# EAGLE design USB-Weather (EAGLE 6.5.0)

## Sheet 1 of 2
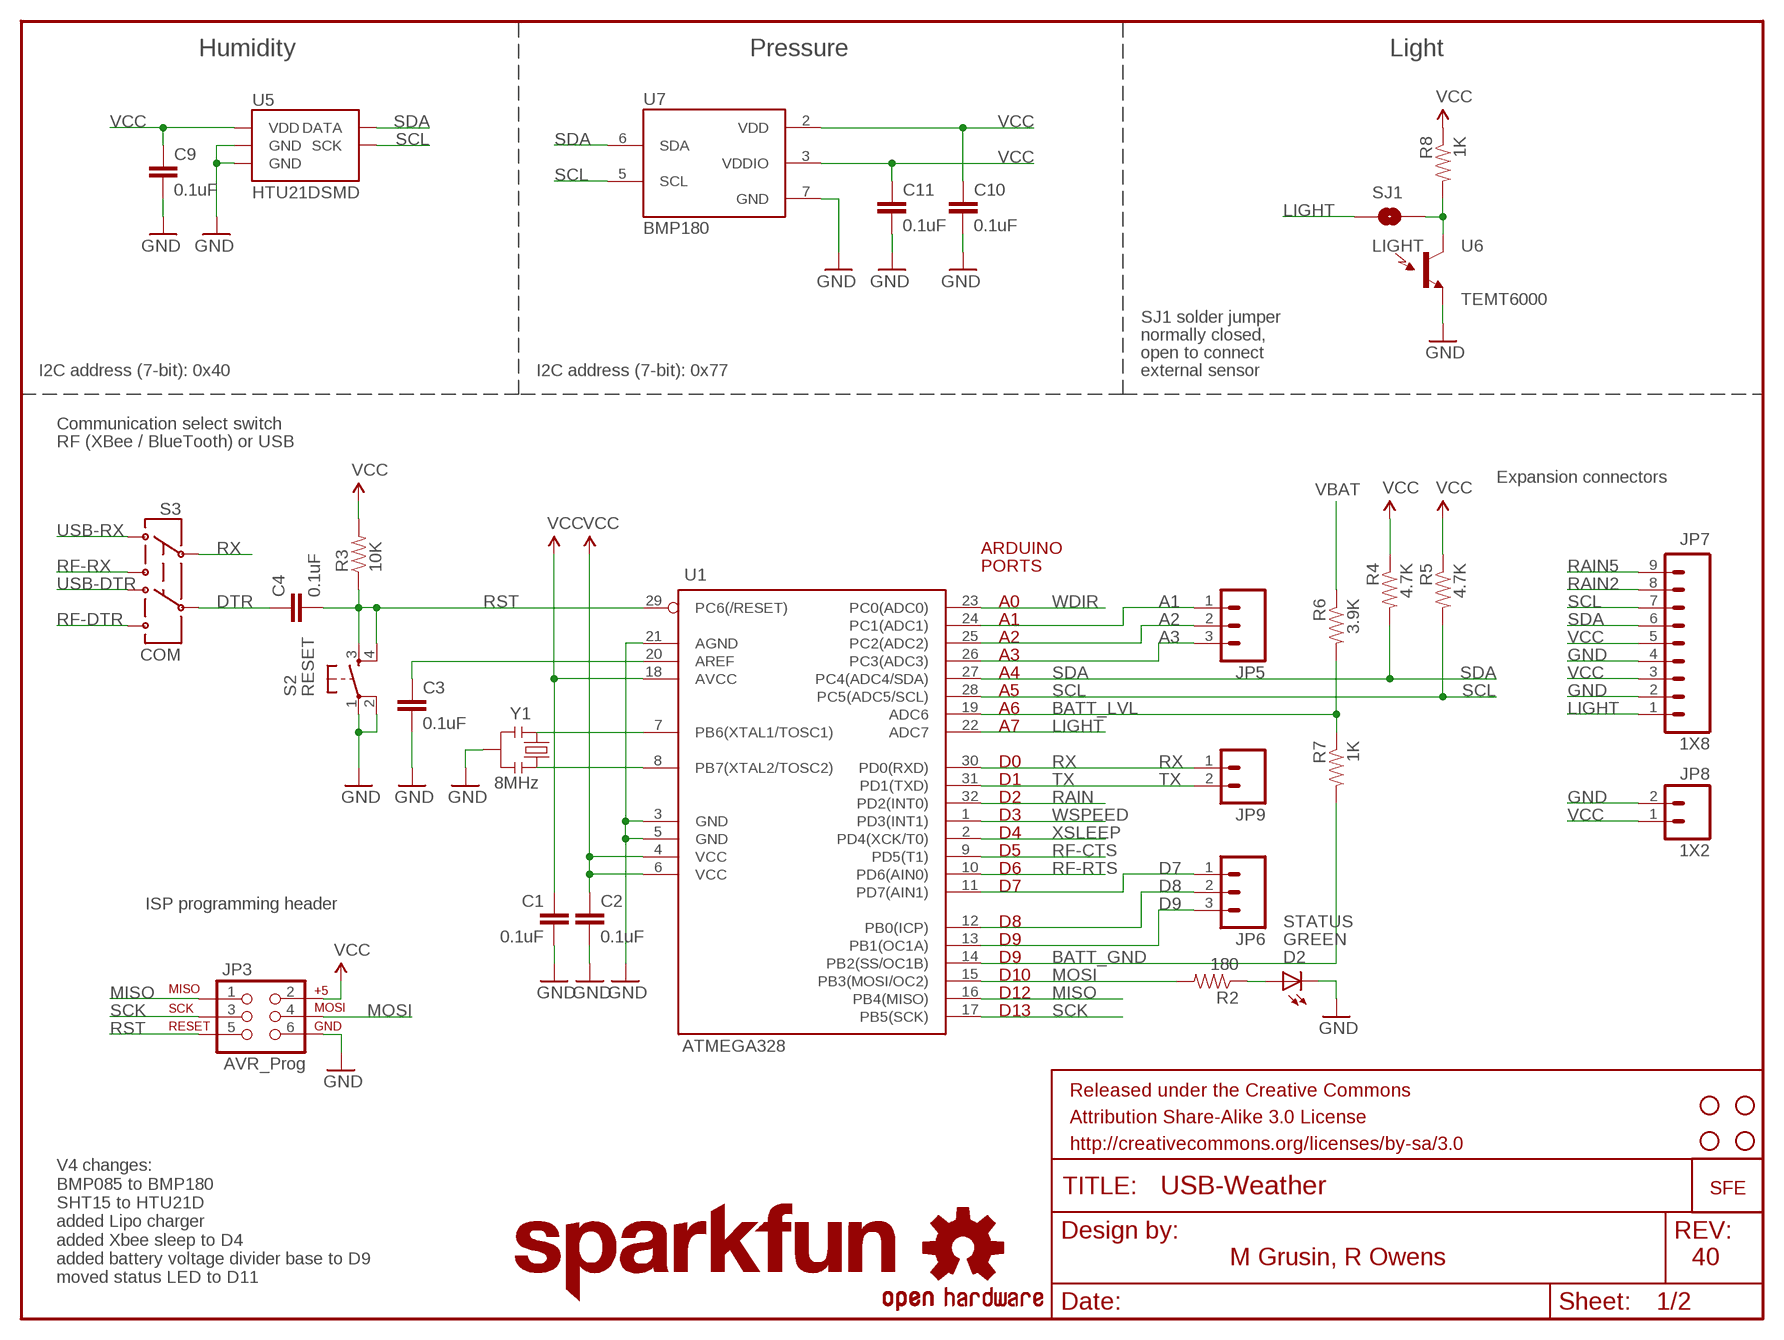
[diagram p0: schematic, sheet 1]

### Parts
C1  0.1uF  CAP0603-CAP  [0603-CAP]
C2  0.1uF  CAP0603-CAP  [0603-CAP]
C3  0.1uF  CAP0603-CAP  [0603-CAP]
C4  0.1uF  CAP0603-CAP  [0603-CAP]
C9  0.1uF  CAP0603-CAP  [0603-CAP]
C10  0.1uF  CAP0603-CAP  [0603-CAP]
C11  0.1uF  CAP0603-CAP  [0603-CAP]
D2  GREEN  LED0603  [LED-0603]
FRAME3  FRAME-LETTER  [CREATIVE_COMMONS]
JP3  AVR_Prog  AVR_SPI_PRG_6PTH  [2X3]
JP5  M03_ROUND_ONLY_NO_SILK  [1X03_ROUND_ONLY_NO_SILK]
JP6  M03_ROUND_ONLY_NO_SILK  [1X03_ROUND_ONLY_NO_SILK]
JP7  1X8  M09  [1X09]
JP8  1X2  M021X02_NO_SILK  [1X02_NO_SILK]
JP9  M021X02_NO_SILK  [1X02_NO_SILK]
LOGO1  LOGO-SFENEW  [SFE-NEW-WEBLOGO]
LOGO2  OSHW-LOGOS  [OSHW-LOGO-S]
LOGO3  SFE_LOGO_NAME.1_INCH  [SFE_LOGO_NAME_.1]
R2  180  RESISTOR0603-RES  [0603-RES]
R3  10K  RESISTOR0603-RES  [0603-RES]
R4  4.7K  RESISTOR0603-RES  [0603-RES]
R5  4.7K  RESISTOR0603-RES  [0603-RES]
R6  3.9K  RESISTOR0603-RES  [0603-RES]
R7  1K  RESISTOR0603-RES  [0603-RES]
R8  1K  RESISTOR0603-RES  [0603-RES]
S2  RESET  TAC_SWITCHSMD  [TACTILE_SWITCH_SMD]
S3  COM  SWITCH-DPDTSMD  [AYZ0202]
SJ1  LIGHT  SOLDERJUMPERNC  [SJ_2S]
U1  ATMEGA328  AVR-MEGA8-AI  [TQFP32-08]
U5  HTU21DSMD  [HTU21D]
U6  TEMT6000  [TEMT6000-SEN]
U7  BMP180  [BMP180]
U$2  STAND-OFF  [STAND-OFF]
U$3  STAND-OFF  [STAND-OFF]
U$4  STAND-OFF  [STAND-OFF]
U$5  STAND-OFF  [STAND-OFF]
Y1  8MHz  RESONATORSMD  [RESONATOR-SMD]

### Nets
A1: JP5.1 U1.24(PC1(ADC1))
A2: JP5.2 U1.25(PC2(ADC2))
A3: JP5.3 U1.26(PC3(ADC3))
BATT_GND: R7.2 U1.14(PB2(SS/OC1B))
BATT_LVL: R6.2 R7.1 U1.19(ADC6)
D7: JP6.1 U1.11(PD7(AIN1))
D8: JP6.2 U1.12(PB0(ICP))
D9: JP6.3 U1.13(PB1(OC1A))
DTR: C4.1 S3.5
GND: C1.2 C2.2 C3.2 C9.2 C10.2 C11.2 D2.C JP3.6 JP7.2 JP7.4 JP8.2 S2.1 S2.2 U1.3(GND) U1.5(GND) U1.21(AGND) U5.7(GND) U5.GND U6.EMITTER(E1) U7.7(GND) Y1.2 ; also sheet 2
LIGHT: JP7.1 SJ1.1 U1.22(ADC7)
MISO: JP3.1 U1.16(PB4(MISO))
MOSI: JP3.4 R2.2 U1.15(PB3(MOSI/OC2))
N$5: D2.A R2.1
N$8: C3.1 U1.20(AREF)
N$9: R8.2 SJ1.2 U6.COLLECTOR(C1)
N$10: U1.7(PB6(XTAL1/TOSC1)) Y1.1
N$14: U1.8(PB7(XTAL2/TOSC2)) Y1.3
RAIN: U1.32(PD2(INT0)) ; also sheet 2
RAIN2: JP7.8 ; also sheet 2
RAIN5: JP7.9 ; also sheet 2
RF-CTS: U1.9(PD5(T1)) ; also sheet 2
RF-DTR: S3.6 ; also sheet 2
RF-RTS: U1.10(PD6(AIN0)) ; also sheet 2
RF-RX: S3.3 ; also sheet 2
RST: C4.2 JP3.5 R3.1 S2.3 S2.4 U1.29(PC6(/RESET))
RX: JP9.1 S3.2 U1.30(PD0(RXD))
SCK: JP3.3 U1.17(PB5(SCK))
SCL: JP7.7 R5.2 U1.28(PC5(ADC5/SCL)) U5.SCK U7.5(SCL)
SDA: JP7.6 R4.2 U1.27(PC4(ADC4/SDA)) U5.DATA U7.6(SDA)
TX: JP9.2 U1.31(PD1(TXD)) ; also sheet 2
USB-DTR: S3.4 ; also sheet 2
USB-RX: S3.1 ; also sheet 2
VBAT: R6.1 ; also sheet 2
VCC: C1.1 C2.1 C9.1 C10.1 C11.1 JP3.2 JP7.3 JP7.5 JP8.1 R3.2 R4.1 R5.1 R8.1 U1.4(VCC) U1.6(VCC) U1.18(AVCC) U5.VDD U7.2(VDD) U7.3(VDDIO) ; also sheet 2
WDIR: U1.23(PC0(ADC0)) ; also sheet 2
WSPEED: U1.1(PD3(INT1)) ; also sheet 2
XSLEEP: U1.2(PD4(XCK/T0)) ; also sheet 2

### Notes on the sheet
- Humidity | Pressure | Light
- SJ1 solder jumper
- normally closed,
- open to connect
- I2C address (7-bit): 0x40 | I2C address (7-bit): 0x77 | external sensor
- Communication select switch
- RF (XBee / BlueTooth) or USB
- Expansion connectors
- ARDUINO
- PORTS
- A0
- A1
- A2
- A3
- A4
- A5
- A6
- A7
- D0
- D1
- D2
- D3
- D4
- D5
- D6
- D7
- ISP programming header
- D8 | STATUS
- D9
- D9
- D10
- D12
- D13
- M Grusin, R Owens | 40
- V4 changes:
  BMP085 to BMP180
  SHT15 to HTU21D
  added Lipo charger
  added Xbee sleep to D4
  added battery voltage divider base to D9
  moved status LED to D11

## Sheet 2 of 2
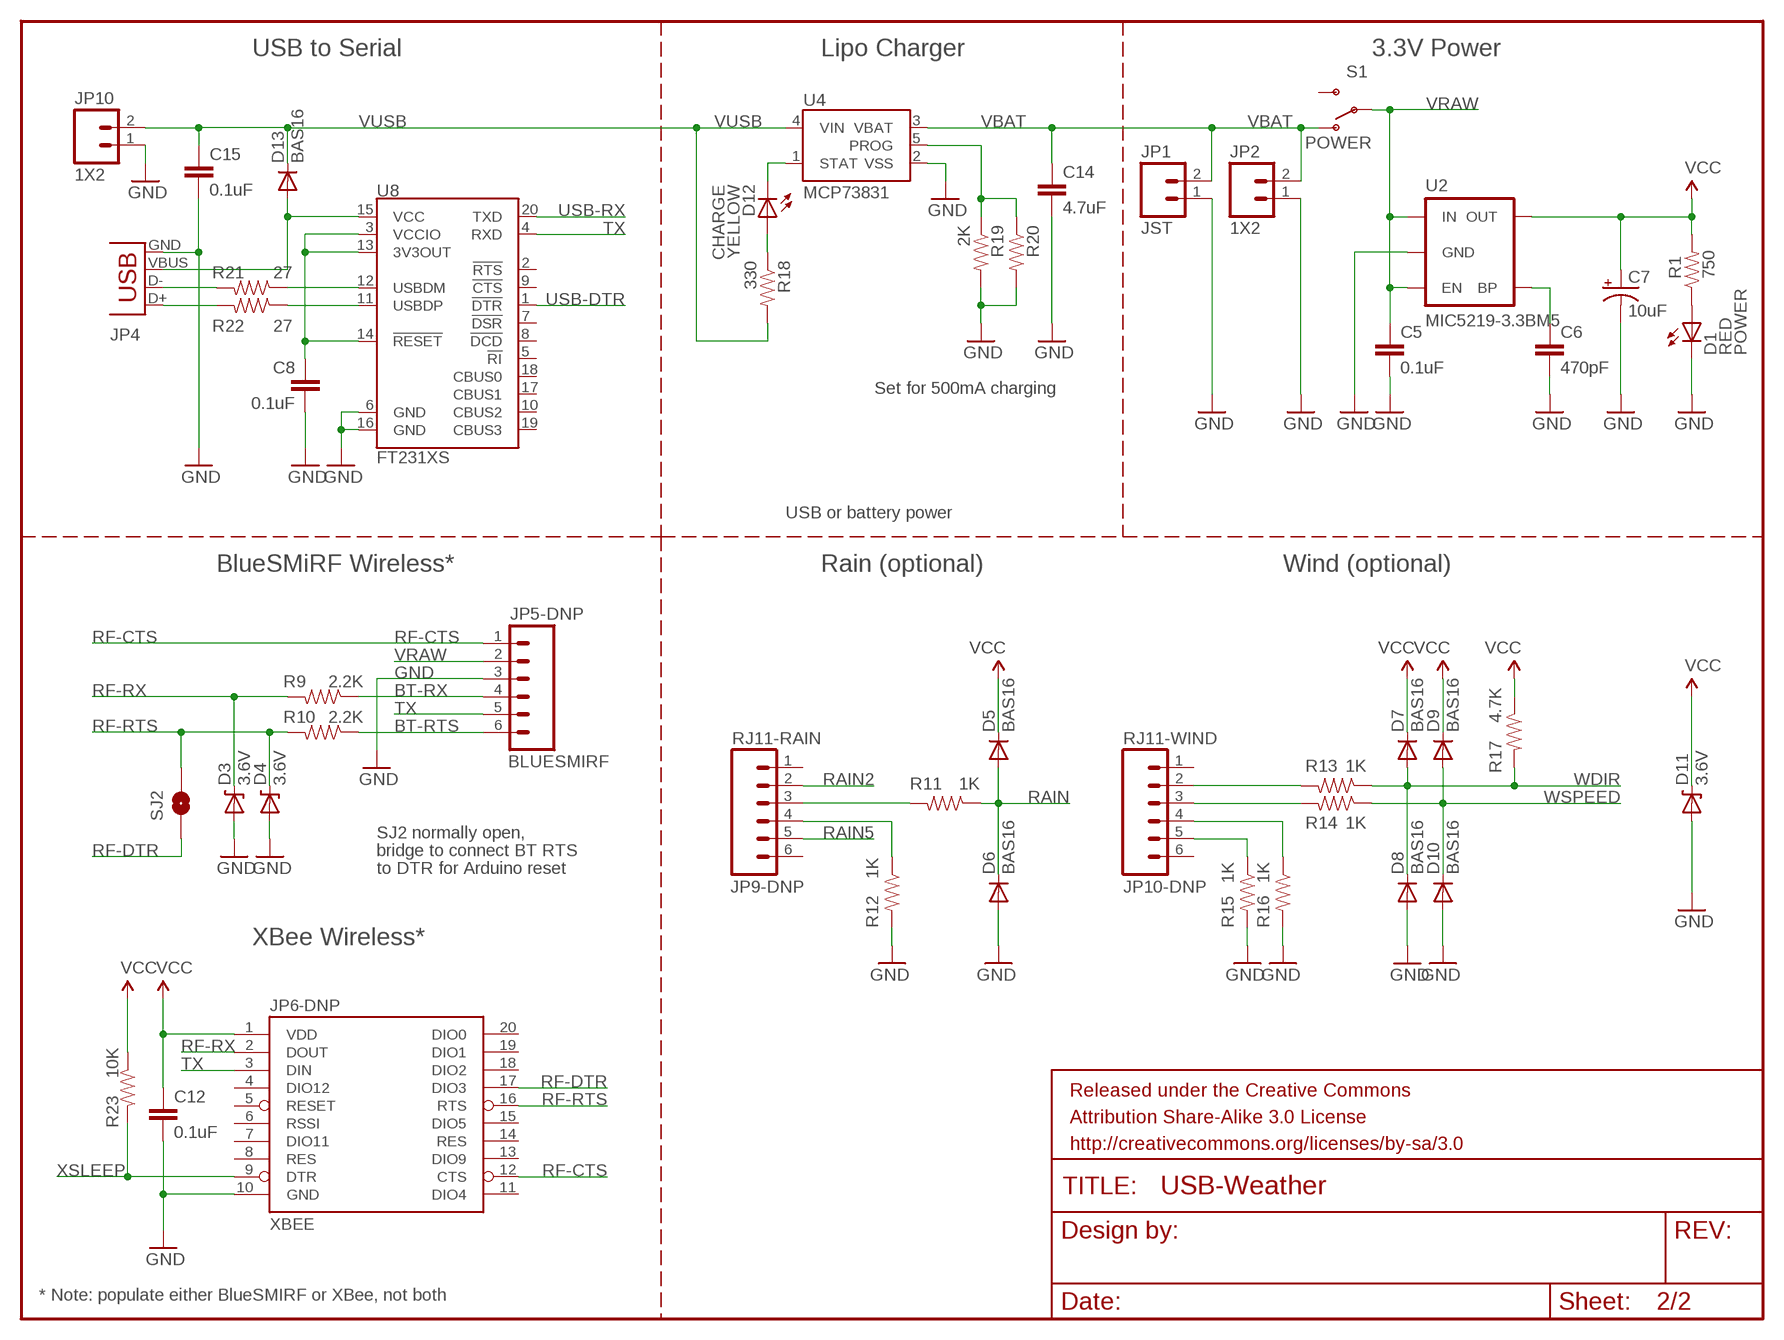
[diagram p1: schematic, sheet 2]

### Parts
C5  0.1uF  CAP0603-CAP  [0603-CAP]
C6  470pF  CAP0603-CAP  [0603-CAP]
C7  10uF  CAP_POL1206  [EIA3216]
C8  0.1uF  CAP0603-CAP  [0603-CAP]
C12  0.1uF  CAP0603-CAP  [0603-CAP]
C14  4.7uF  CAP0603-CAP  [0603-CAP]
C15  0.1uF  CAP0603-CAP  [0603-CAP]
D1  RED  LED0603  [LED-0603]
D3  3.6V  DIODE-ZENER-BZT52  [SOD-323]
D4  3.6V  DIODE-ZENER-BZT52  [SOD-323]
D5  BAS16  DIODESOD  [SOD-323]
D6  BAS16  DIODESOD  [SOD-323]
D7  BAS16  DIODESOD  [SOD-323]
D8  BAS16  DIODESOD  [SOD-323]
D9  BAS16  DIODESOD  [SOD-323]
D10  BAS16  DIODESOD  [SOD-323]
D11  3.6V  DIODE-ZENER-BZT52  [SOD-323]
D12  YELLOW  LED0603  [LED-0603]
D13  BAS16  DIODESOD  [SOD-323]
FRAME1  FRAME-LETTER  [CREATIVE_COMMONS]
JP1  JST  M02-JST-2MM-SMT  [JST-2-SMD]
JP2  1X2  M021X02_NO_SILK  [1X02_NO_SILK]
JP4  USBSMD  [USB-MINIB]
JP5-DNP  BLUESMIRF  M06SIP  [1X06]
JP6-DNP  XBEE  XBEE-1B1  [XBEE-1]
JP9-DNP  RJ11-RAIN  RJ11-6PTH  [RJ11-6]
JP10  1X2  M021X02_NO_SILK  [1X02_NO_SILK]
JP10-DNP  RJ11-WIND  RJ11-6PTH  [RJ11-6]
R1  750  RESISTOR0603-RES  [0603-RES]
R9  2.2K  RESISTOR0603-RES  [0603-RES]
R10  2.2K  RESISTOR0603-RES  [0603-RES]
R11  1K  RESISTOR0603-RES  [0603-RES]
R12  1K  RESISTOR0603-RES  [0603-RES]
R13  1K  RESISTOR0603-RES  [0603-RES]
R14  1K  RESISTOR0603-RES  [0603-RES]
R15  1K  RESISTOR0603-RES  [0603-RES]
R16  1K  RESISTOR0603-RES  [0603-RES]
R17  4.7K  RESISTOR0603-RES  [0603-RES]
R18  330  RESISTOR0603-RES  [0603-RES]
R19  2K  RESISTOR0603-RES  [0603-RES]
R20  RESISTORPTH-1/6W  [1/6W-RES]
R21  27  RESISTOR0603-RES  [0603-RES]
R22  27  RESISTOR0603-RES  [0603-RES]
R23  10K  RESISTOR0603-RES  [0603-RES]
S1  POWER  SWITCH-SPSTSMD  [AYZ0202]
SJ2  SOLDERJUMPERNO  [SJ_2S-NO]
U2  MIC5219-3.3BM5  V_REG_LDOSMD  [SOT23-5]
U4  MCP73831  [SOT23-5]
U8  FT231XS  [SSOP20_L]

### Nets
BT-RTS: JP5-DNP.6 R10.1
BT-RX: JP5-DNP.4 R9.1
GND: C5.2 C6.2 C7.C(-) C8.2 C12.2 C14.2 C15.2 D1.C D3.2(A) D4.2(A) D6.2(A) D8.2(A) D10.2(A) D11.2(A) JP1.1 JP2.1 JP4.GND JP5-DNP.3 JP6-DNP.10(GND) JP10.1 R12.2 R15.2 R16.2 R19.2 R20.2 U2.2(GND) U4.2(VSS) U8.6(GND) U8.16(GND) ; also sheet 1
N$1: D1.A R1.1
N$2: JP10-DNP.2 R13.2
N$3: JP10-DNP.3 R14.2
N$6: C6.1 U2.4(BP)
N$7: JP9-DNP.3 R11.2
N$11: JP9-DNP.4 R12.1
N$12: JP10-DNP.5 R15.1
N$13: JP10-DNP.4 R16.1
N$22: D12.A R18.1
N$23: JP4.D- R21.2
N$24: JP4.D+ R22.2
N$25: D13.2(A) JP4.VBUS U8.15(VCC)
N$26: C8.1 U8.3(VCCIO) U8.13(3V3OUT) U8.14(!RESET)
PROG: R19.1 R20.1 U4.5(PROG)
RAIN: D5.2(A) D6.1(C) R11.1 ; also sheet 1
RAIN2: JP9-DNP.2 ; also sheet 1
RAIN5: JP9-DNP.5 ; also sheet 1
RF-CTS: JP5-DNP.1 JP6-DNP.12(CTS) ; also sheet 1
RF-DTR: JP6-DNP.17(DIO3) SJ2.1 ; also sheet 1
RF-RTS: D4.1(C) JP6-DNP.16(RTS) R10.2 SJ2.2 ; also sheet 1
RF-RX: D3.1(C) JP6-DNP.2(DOUT) R9.2 ; also sheet 1
STAT: D12.C U4.1(STAT)
TX: JP5-DNP.5 JP6-DNP.3(DIN) U8.4(RXD) ; also sheet 1
USB-DTR: U8.1(!DTR) ; also sheet 1
USB-RX: U8.20(TXD) ; also sheet 1
USB_D+: R22.1 U8.11(USBDP)
USB_D-: R21.1 U8.12(USBDM)
VBAT: C14.1 JP1.2 JP2.2 S1.1(O) U4.3(VBAT) ; also sheet 1
VCC: C7.A(+) C12.1 D5.1(C) D7.1(C) D9.1(C) D11.1(C) JP6-DNP.1(VDD) R1.2 R17.1 R23.1 U2.5(OUT) ; also sheet 1
VRAW: C5.1 JP5-DNP.2 S1.2(P) U2.1(IN) U2.3(EN)
VUSB: C15.1 D13.1(C) JP10.2 R18.2 U4.4(VIN)
WDIR: D7.2(A) D8.1(C) R13.1 R17.2 ; also sheet 1
WSPEED: D9.2(A) D10.1(C) R14.1 ; also sheet 1
XSLEEP: JP6-DNP.9(DTR) R23.2 ; also sheet 1
Unconnected: JP6-DNP.4(DIO12) JP6-DNP.5(RESET) JP6-DNP.6(RSSI) JP6-DNP.7(DIO11) JP6-DNP.8(RES) JP6-DNP.11(DIO4) JP6-DNP.13(DIO9) JP6-DNP.14(RES) JP6-DNP.15(DIO5) JP6-DNP.18(DIO2) JP6-DNP.19(DIO1) JP6-DNP.20(DIO0) JP9-DNP.1 JP9-DNP.6 JP10-DNP.1 JP10-DNP.6 S1.3(S) U8.2(!RTS) U8.5(!RI) U8.7(!DSR) U8.8(!DCD) U8.9(!CTS) U8.10(CBUS2) U8.17(CBUS1) U8.18(CBUS0) U8.19(CBUS3)

### Notes on the sheet
- USB to Serial | Lipo Charger | 3.3V Power
- CHARGE
- JP4
- POWER
- Set for 500mA charging
- USB or battery power
- Rain (optional) | Wind (optional)
- BlueSMiRF Wireless*
- SJ2 normally open,
- bridge to connect BT RTS
- to DTR for Arduino reset
- XBee Wireless*
- * Note: populate either BlueSMIRF or XBee, not both

## Library data of the parts
C1-C6 C8-C12 C14 C15 = SparkFun:CAP: Capacitor Standard 0603 ceramic capacitor, and 0.1" leaded capacitor.
C7 = SparkFun:CAP_POL: Capacitor Polarized These are standard SMD and PTH capacitors. Normally 10uF, 47uF, and 100uF in electrolytic and tantalum varieties. Always verify the external diameter of the through hole cap, it varies with capacity, voltage, and manufacturer. The EIA devices should be standard.
D1 D2 D12 = SparkFun:LED: LEDs Standard schematic elements and footprints for 5mm, 3mm, 1206, and 0603 sized LEDs. 5mm - Spark Fun Electronics SKU : COM-00529 (and others)
D3 D4 D11 = SparkFun:DIODE-ZENER: Zener Diode Production Part - 8199 3.4V Zener Voltage
D5-D10 D13 = SparkFun:DIODE: Diode These are standard reverse protection diodes and small signal diodes. SMA package can handle up to about 1A. SOD-323 can handle about 200mA. What the SOD-323 package when ordering, there are some mfgs out there that are 5-pin packages.
FRAME1 FRAME3 = SparkFun-Aesthetics:FRAME-LETTER: Schematic Frame Standard 8.5x11 US Letter frame
JP1 JP2 JP10 = SparkFun:M02: Header 2 Standard 2-pin 0.1" header. Use with straight break away headers (SKU : PRT-00116), right angle break away headers (PRT-00553), swiss pins (PRT-00743), machine pins (PRT-00117), and female headers (PRT-00115). Molex polarized connector foot print use with SKU : PRT-08233 with associated crimp pins and housings.
JP3 = mike-temp:AVR_SPI_PRG_6: AVR ISP 6 Pin This is the reduced ISP connector for AVR programming. Common on Arduino. This footprint will take up less PCB space and can be used with a 10-pin to 6-pin adapter such as SKU: BOB-08508
JP4 = SparkFun:USB: USB Connectors USB-B-PTH is fully proven SKU : PRT-00139 USB-miniB is fully proven SKU : PRT-00587 USB-A-PCB is untested. USB-A-H is throughly reviewed, but untested. Spark Fun Electronics SKU : PRT-00437 USB-B-SMT is throughly reviewed, but untested. Needs silkscreen touching up. USB-A-S has not been used/tested USB-MB-H has not been used/tested
JP5 JP6 = mike-temp:M03: Header 3 Standard 3-pin 0.1" header. Use with straight break away headers (SKU : PRT-00116), right angle break away headers (PRT-00553), swiss pins (PRT-00743), machine pins (PRT-00117), and female headers (PRT-00115). Molex polarized connector foot print use with SKU : PRT-08232 with associated crimp pins and housings.
JP5-DNP = SparkFun:M06: Header 6 Standard 6-pin 0.1" header. Use with straight break away headers (SKU : PRT-00116), right angle break away headers (PRT-00553), swiss pins (PRT-00743), machine pins (PRT-00117), and female headers (PRT-00115). Molex polarized connector foot print use with SKU : PRT-08094 with associated crimp pins and housings. NOTES ON THE VARIANTS LOCK and LOCK_LONGPADS... This footprint was designed to help hold the alignment of a through-hole component (i.e. 6-pin header) while soldering it into place. You may notice that each hole has been shifted either up or down by 0.005 of an inch from it's more standard position (which is a perfectly straight line). This slight alteration caused the pins (the squares in the middle) to touch the edges of the holes. Because they are alternating, it causes a "brace" to hold the component in place. 0.005 has proven to be the perfect amount of "off-center" position when using our standard breakaway headers. Although looks a little odd when you look at the bare footprint, once you have a header in there, the alteration is very hard to notice. Also, if you push a header all the way into place, it is covered up entirely on the bottom side. This idea of altering the position of holes to aid alignment will be further integrated into the Sparkfun Library for other footprints. It can help hold any component with 3 or more connection pins.
JP6-DNP = SparkFun:XBEE-1
JP7 = SparkFun:M09: Header 9 Standard 9-pin 0.1" header. Use with straight break away headers (SKU : PRT-00116), right angle break away headers (PRT-00553), swiss pins (PRT-00743), machine pins (PRT-00117), and female headers (PRT-00115).
JP8 JP9 = mike-temp:M02: Header 2 Standard 2-pin 0.1" header. Use with straight break away headers (SKU : PRT-00116), right angle break away headers (PRT-00553), swiss pins (PRT-00743), machine pins (PRT-00117), and female headers (PRT-00115). Molex polarized connector foot print use with SKU : PRT-08233 with associated crimp pins and housings.
JP9-DNP JP10-DNP = SparkFun:RJ11-6: RJ11 Jack Simple 6 pin RJ11 jack. Commonly found on CAT3 devices and Microchip programmers. SKU: PRT-00132
LOGO1 = SparkFun-Aesthetics:LOGO-SFE: Spark Fun Electronics PCB Logo This is the standard Spark Fun Electronics PCB logo.
LOGO2 = SparkFun-Aesthetics:OSHW-LOGO: Open Source Hardware Logo This logo indicates the piece of hardware it is found on incorporates a OSHW license and/or adheres to the definition of open source hardware found here: http://freedomdefined.org/OSHW
LOGO3 = SparkFun-Aesthetics:SFE_LOGO_NAME: SFE Logo, name only This is the SparkFun name logo. The logo on the schematic will always be the same size; the package variant is the height of the flame part of the logo (or the height the flame would be, if it were drawn). Default layer for the logo on the board is tSilk.
R1-R23 = SparkFun:RESISTOR: Resistor Basic schematic elements and footprints for 0603, 1206, and PTH resistors.
S1 = SparkFun:SWITCH-SPST: SPST Switch Simple slide switch. Spark Fun Electronics SKU : COM-00102
S2 = SparkFun:TAC_SWITCH: Momentary Switch Button commonly used for reset or general input. Spark Fun Electronics SKU : COM-00097
S3 = SparkFun:SWITCH-DPDT: DPDT Version of the COM-00597
SJ1 SJ2 = SparkFun:SOLDERJUMPER: Solder Jumper Standard SMD solder jumper. Used to automate production. Two varients : Normally Open and Normally Closed are the same, but have different paste layers. NC will have a large amount of paste and should jumper during reflow.
U1 = SparkFun:AVR-MEGA8: MICROCONTROLLER 8 Kbytes FLASH 1 kbytes SRAM 512 bytes EEPROM USART 6-channel 10 bit ADC 2-channel 8 bit ADC
U2 = SparkFun:V_REG_LDO: Voltage Regulator LDO Standard 150mA LDO voltage regulator in SOT-23 layout. Micrel part MIC5205. BP (by-pass) pin is used to lower output noise with 470pF cap.; SFENUM: VREG-9872
U4 = SparkFun:MCP73831: Microchip's MCP73831 Miniature single cell, fully integrated Li-Ion, Li-polymer charge management controller http://ww1.microchip.com/downloads/en/DeviceDoc/21984a.pdf
U5 = SparkFun-Sensors:HTU21D
U6 = SparkFun:TEMT6000: Ambient Light Sensor Simple light detection sensor. Output varies with light intensity input. Spark Fun Electronics SKU : COM-08348
U7 = SparkFun-Sensors:BMP180: BOSCH BMP180 DIGITAL BAROMETRIC PRESSURE SENSOR Web page: http://www.bosch-sensortec.com/en/homepage/products_3/environmental_sensors_1/bmp180_1/bmp180 Datasheet: http://ae-bst.resource.bosch.com/media/products/dokumente/bmp180/BST-BMP180-DS000-09.pdf The BMP180 is the function compatible successor of the BMP085, a new generation of high precision digital pressure sensors for consumer applications. The ultra-low power, low voltage electronics of the BMP180 is optimized for use in mobile phones, PDAs, GPS navigation devices and outdoor equipment. With a low altitude noise of merely 0.25m at fast conversion time, the BMP180 offers superior performance. The I2C interface allows for easy system integration with a microcontroller. The BMP180 is based on piezo-resistive technology for EMC robustness, high accuracy and linearity as well as long term stability. Key features: - Temperature measurement included - I2C interface - Fully calibrated - Pb-free, halogen-free and RoHS compliant, - MSL 1 Basic specs: Pressure range: 300 to 1100hPa (+9000m to -500m relating to sea level) Supply voltage: 1.8 to 3.6V (VDD), 1.62V to 3.6V (VDDIO) Package: LGA package with metal lid Small footprint: 3.6mm x 3.8mm Super-flat: 0.93mm height Low power: 5μA at 1 sample / sec. in standard mode Low noise: 0.06hPa (0.5m) in ultra low power mode, 0.02hPa (0.17m) advanced resolution mode Typical applications: - Enhancement of GPS navigation (dead-reckoning, slope detection, etc.) - In- and out-door navigation - Leisure and sports - Weather forecast - Vertical velocity indication (rise/sink speed)
U8 = mike-temp:FT231X: FTDI FT231X Full Speed USB to Full-handshake UART This USB2.0 Full Speed IC offers a compact bridge to full handshake UART interfaces. The device is a UART, capable of operating up to 3MBaud, with low power consumption (8mA). The FT231X includes the complete FT-X series feature set and enables USB to be added into a system design quickly and easily over a UART interface.
U$2-U$5 = SparkFun:STAND-OFF: Stand Off This is the mechanical footprint for a #4 phillips button head screw. Use the keepout ring to avoid running the screw head into surrounding components. SKU : PRT-00447
Y1 = SparkFun:RESONATOR: Resonator Small SMD resonator. This is the itty bitty 10/20MHz resonators with built in caps. CSTCE10M0G55 and CSTCE20M0V53. Footprint has been reviewed closely but hasn't been tested yet.

## Net classes
0 Default: width 0.203 mm
1 Power: width 0.305 mm

## Board
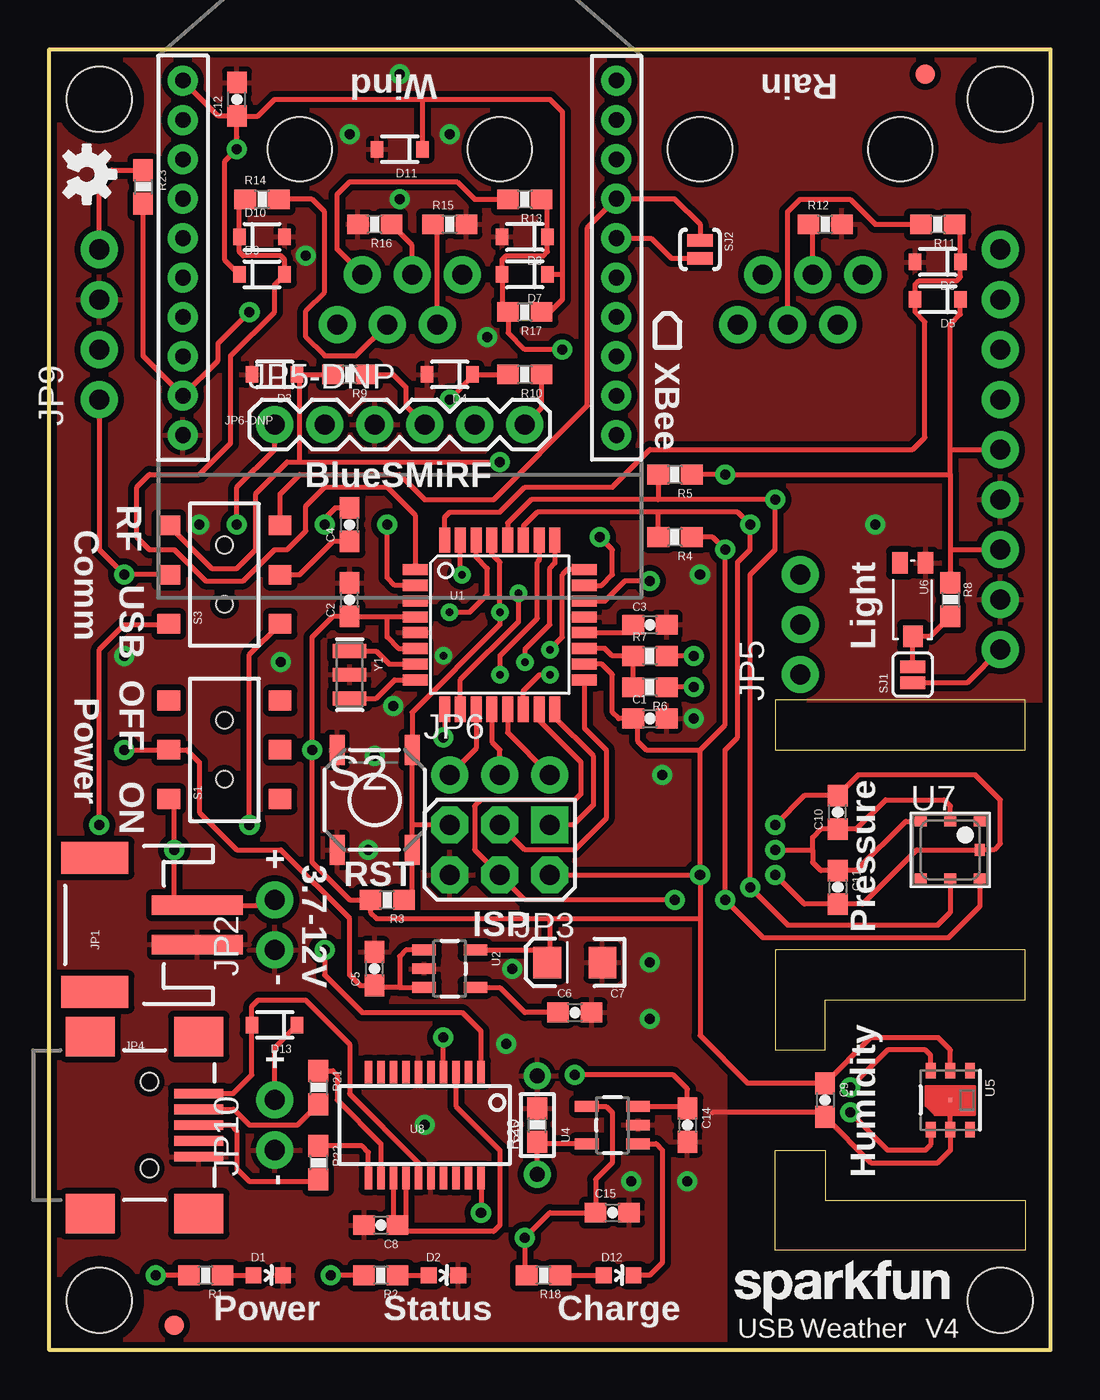
[diagram p2: board, top side]
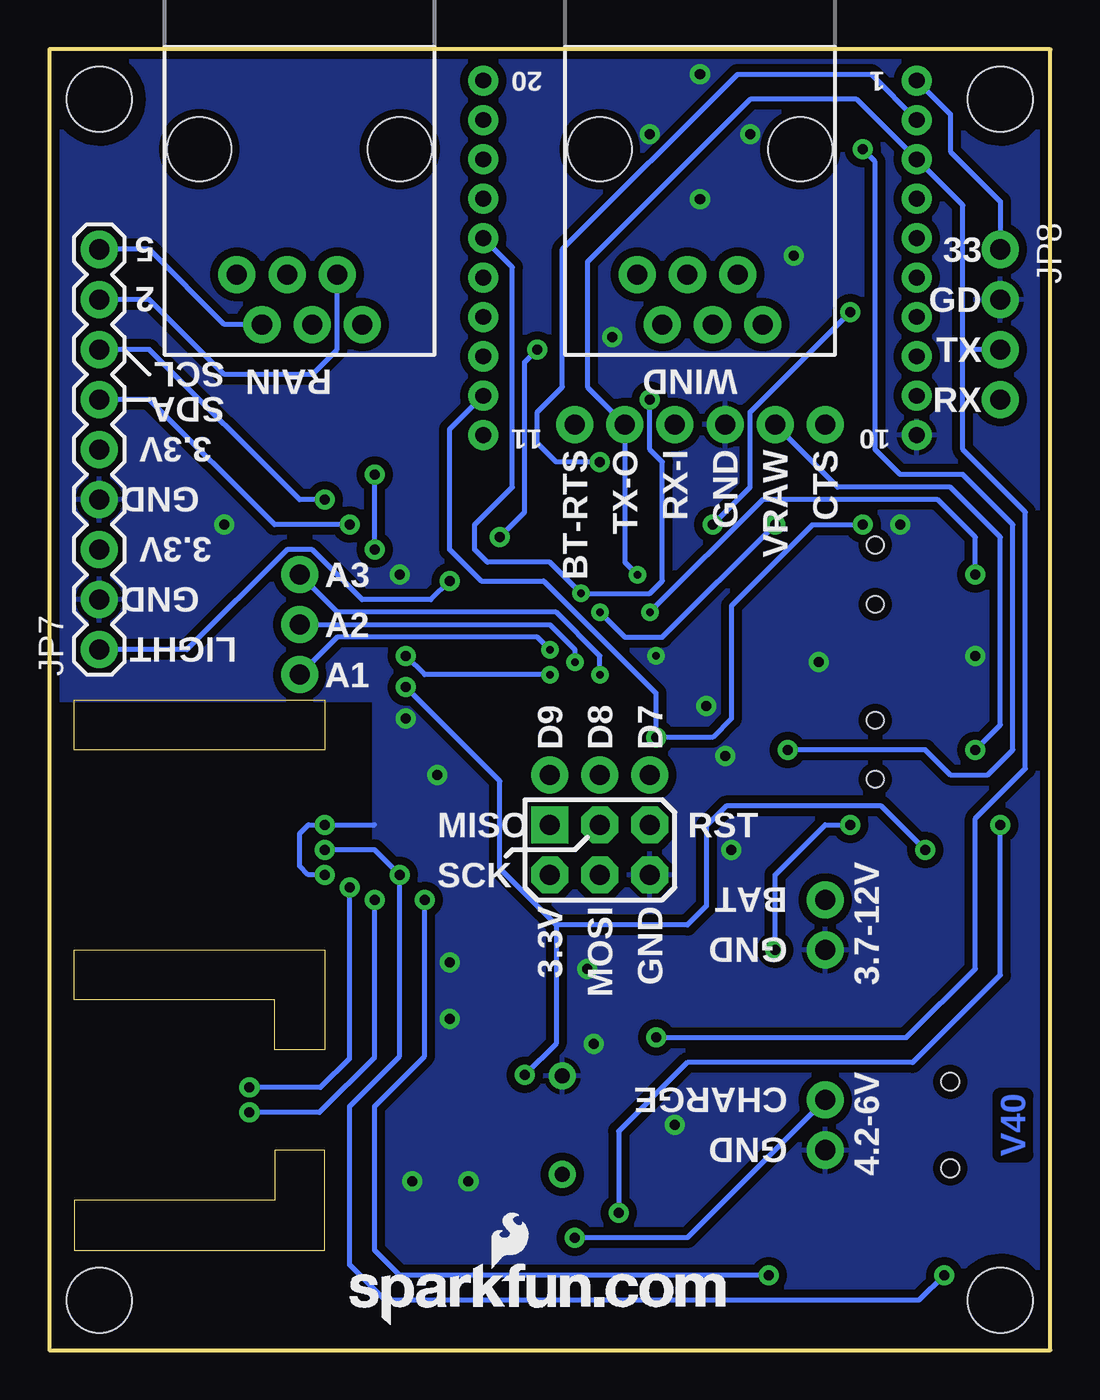
[diagram p3: board, bottom side, seen from below]

Size 50.8 x 66.04 mm. Coordinates in mm from the lower left corner, seen from the top.
Outline: 0,66.04 50.8,66.04 50.8,0 0,0 0,66.04
Copper layers (1*16): Top 0.035mm / dielectric 1.5mm / Bottom 0.035mm
Design rules "SparkFun": minimum track width 7mil, minimum drill 15mil, track to track 8mil, track to pad 8mil, pad to pad 8mil, via to via 8mil, smd to smd 8mil, copper to edge 8mil, drill to drill 8mil, minimum pad ring 12mil, minimum via ring 10mil, stop-mask expansion 4mil, vias tented up to drill 20mil, thermal gap 10mil
Milling: area 36.8,15.2 to 49.5,20.3; area 36.8,5.1 to 49.5,10.2; area 36.8,30.5 to 49.5,33

### Footprints (pad centres in the part's own frame; a part is rotated, then mirrored left to right if it is on the bottom)
0603-CAP = smd 1.1 x 1: 1 -0.85,0; 2 0.85,0
EIA3216 = smd 1.4 x 1.6: A 1.4,0; C -1.4,0
LED-0603 = smd 0.8 x 0.8: A 0,-0.75; C 0,0.75
SOD-323 = smd 0.63 x 0.83: 1 -1.15,0; 2 1.15,0
FIDUCIAL-1X2 = smd 1 x 1: 1 0,0
JST-2-SMD = smd 1 x 4.6: 1 -1,-3.7; 2 1,-3.7 | smd 1.6 x 3.4: NC1 -3.4,1.5; NC2 3.4,1.5
1X02_NO_SILK = drill 1.016 pad 1.88: 1 0,0; 2 2.54,0
2X3 = drill 1.016 pad 1.88 square: 1 0,0 | drill 1.016 pad 1.88 octagon: 2 0,2.54; 3 2.54,0; 4 2.54,2.54; 5 5.08,0; 6 5.08,2.54
USB-MINIB = smd 2.5 x 0.5: D+ 2.5,0; D- 2.5,0.8; GND 2.5,-1.6; ID 2.5,-0.8; VBUS 2.5,1.6 | smd 2.5 x 2: MTN1 -3,4.5; MTN2 2.5,4.5; MTN3 -3,-4.5; MTN4 2.5,-4.5 | hole 0.9: 0,2.2; 0,-2.2
1X03_ROUND_ONLY_NO_SILK = drill 1.016 pad 1.88: 1 0,0; 2 2.54,0; 3 5.08,0
1X06 = drill 1.016 pad 1.88: 1 0,0; 2 2.54,0; 3 5.08,0; 4 7.62,0; 5 10.16,0; 6 12.7,0
XBEE-1 = drill 0.8 pad 1.524: 1 -11,20; 2 -11,18; 3 -11,16; 4 -11,14; 5 -11,12; 6 -11,10; 7 -11,8; 8 -11,6; 9 -11,4; 10 -11,2; 11 11,2; 12 11,4; 13 11,6; 14 11,8; 15 11,10; 16 11,12; 17 11,14; 18 11,16; 19 11,18; 20 11,20
1X09 = drill 1.016 pad 1.88: 1 0,0; 2 2.54,0; 3 5.08,0; 4 7.62,0; 5 10.16,0; 6 12.7,0; 7 15.24,0; 8 17.78,0; 9 20.32,0
RJ11-6 = drill 1.016 pad 1.88: 1 1.905,8.89; 2 3.175,6.35; 3 4.445,8.89; 4 5.715,6.35; 5 6.985,8.89; 6 8.255,6.35 | hole 3.251: 0,0; 10.16,0
0603-RES = smd 1.1 x 1: 1 -0.85,0; 2 0.85,0
1/6W-RES = drill 0.762: 1 -2.5,0; 2 2.5,0
AYZ0202 = smd 1 x 1.15: 1 -2.5,2.825; 2 0,2.825; 3 2.5,2.825; 4 -2.5,-2.825; 5 0,-2.825; 6 2.5,-2.825 | hole 0.85: 1.5,0; -1.5,0
TACTILE_SWITCH_SMD = smd 1.524 x 0.762: 1 -2.54,1.905; 2 2.54,1.905; 3 -2.54,-1.905; 4 2.54,-1.905
SJ_2S = smd 0.635 x 1.27: 1 -0.412,0; 2 0.412,0
SJ_2S-NO = smd 0.635 x 1.27: 1 -0.45,0; 2 0.45,0
TQFP32-08 = smd 1.27 x 0.559: 1 -4.293,2.8; 2 -4.293,2; 3 -4.293,1.2; 4 -4.293,0.4; 5 -4.293,-0.4; 6 -4.293,-1.2; 7 -4.293,-2; 8 -4.293,-2.8; 17 4.293,-2.8; 18 4.293,-2; 19 4.293,-1.2; 20 4.293,-0.4; 21 4.293,0.4; 22 4.293,1.2; 23 4.293,2; 24 4.293,2.8 | smd 0.559 x 1.27: 9 -2.8,-4.293; 10 -2,-4.293; 11 -1.2,-4.293; 12 -0.4,-4.293; 13 0.4,-4.293; 14 1.2,-4.293; 15 2,-4.293; 16 2.8,-4.293; 25 2.8,4.293; 26 2,4.293; 27 1.2,4.293; 28 0.4,4.293; 29 -0.4,4.293; 30 -1.2,4.293; 31 -2,4.293; 32 -2.8,4.293
SOT23-5 = smd 0.55 x 1.2: 1 -0.95,-1.3; 2 0,-1.3; 3 0.95,-1.3; 4 0.95,1.3; 5 -0.95,1.3
HTU21D = smd 0.2 x 0.2: 7 0,0 | smd 0.8 x 0.5: DATA 1.5,-1; GND 1.5,0; NC@1 -1.5,1; NC@6 1.5,1; SCK -1.5,-1; VDD -1.5,0
TEMT6000-SEN = smd 1.1 x 0.8: BASE -1.87,-0.65; EMITTER -1.87,0.65 | smd 1.1 x 1: COLLECTOR 1.86,0.01
BMP180 = smd 0.6 x 0.5: 1 1.5,1.45; 2 0,1.45; 3 -1.5,1.45; 4 -1.5,-1.45; 5 0,-1.45; 6 1.5,-1.45 | smd 0.5 x 0.6: 7 1.5,0
SSOP20_L = smd 0.381 x 1.143: 1 -2.857,-2.68; 2 -2.223,-2.68; 3 -1.587,-2.68; 4 -0.953,-2.68; 5 -0.318,-2.68; 6 0.318,-2.68; 7 0.953,-2.68; 8 1.587,-2.68; 9 2.223,-2.68; 10 2.857,-2.68; 11 2.857,2.68; 12 2.223,2.68; 13 1.587,2.68; 14 0.953,2.68; 15 0.318,2.68; 16 -0.318,2.68; 17 -0.953,2.68; 18 -1.587,2.68; 19 -2.223,2.68; 20 -2.857,2.68
STAND-OFF = hole 3.302: 0,0
RESONATOR-SMD = smd 0.7 x 1.7: 1 -1.2,0; 2 0,0; 3 1.2,0

### Placement (x,y rotation side)
C1  30.48,32.07 0 top
C2  15.24,38.1 90 top
C3  30.48,36.83 0 top
C4  15.24,41.91 90 top
C5  16.51,19.37 90 top
C6  26.67,17.14 0 top
C7  26.67,19.68 180 top
C8  16.83,6.35 180 top
C9  39.37,12.7 270 top
C10  40.01,27.3 90 top
C11  40.01,23.5 270 top
C12  9.53,63.5 90 top
C14  32.38,11.43 270 top
C15  28.57,6.99 0 top
D1  11.11,3.81 270 top
D2  20,3.81 270 top
D3  11.43,49.53 180 top
D4  20.32,49.53 180 top
D5  45.09,53.34 180 top
D6  45.09,55.24 180 top
D7  24.13,54.61 180 top
D8  24.13,56.52 180 top
D9  10.79,54.61 0 top
D10  10.79,56.52 0 top
D11  17.78,60.96 180 top
D12  28.89,3.81 270 top
D13  11.43,16.51 180 top
E$1  [FIDUCIAL-1X2]  44.45,64.77 0 top
E$2  [FIDUCIAL-1X2]  6.35,1.27 0 top
FRAME1  -8.89,-16.51 0 top  (outside the outline)
FRAME3  -8.89,-16.51 0 top  (outside the outline)
JP1  3.81,21.59 90 top
JP2  11.43,20.32 90 top
JP3  25.4,26.67 180 top
JP4  5.08,11.43 0 top
JP5  38.1,34.29 90 top
JP5-DNP  11.43,46.99 0 top
JP6  20.32,29.21 0 top
JP6-DNP  17.78,44.45 0 top
JP7  48.26,35.56 90 bottom
JP8  2.54,55.88 270 bottom
JP9  2.54,48.26 90 top
JP9-DNP  33.02,60.96 180 bottom
JP10  11.43,10.16 90 top
JP10-DNP  12.7,60.96 180 bottom
LOGO1  35.56,1.27 0 bottom
LOGO2  1.91,59.69 270 top
LOGO3  34.29,1.27 0 top
R1  7.94,3.81 180 top
R2  16.83,3.81 180 top
R3  17.14,22.86 180 top
R4  31.75,41.27 180 top
R5  31.75,44.45 180 top
R6  30.48,33.66 180 top
R7  30.48,35.24 0 top
R8  45.72,38.1 270 top
R9  15.24,49.53 180 top
R10  24.13,49.53 180 top
R11  45.09,57.15 180 top
R12  39.37,57.15 0 top
R13  24.13,58.42 180 top
R14  10.79,58.42 0 top
R15  20.32,57.15 0 top
R16  16.51,57.15 180 top
R17  24.13,52.7 180 top
R18  25.08,3.81 180 top
R19  24.77,11.43 90 top
R20  24.77,11.43 90 top
R21  13.65,13.34 270 top
R22  13.65,9.53 270 top
R23  4.76,59.05 270 top
S1  8.89,30.48 90 top
S2  16.51,27.94 90 top
S3  8.89,39.37 90 top
SJ1  43.81,34.29 90 top
SJ2  33.02,55.88 270 top
U1  22.86,36.83 0 top
U2  20.32,19.37 270 top
U4  28.57,11.43 90 top
U5  45.72,12.7 270 top
U6  43.81,38.1 270 top
U7  45.72,25.4 0 top
U8  19.05,11.43 180 top
U$2  2.54,2.54 0 top
U$3  48.26,2.54 0 top
U$4  2.54,63.5 0 top
U$5  48.26,63.5 0 top
Y1  15.24,34.29 270 top

### Tracks (layer width: path | path; a pad name or v marks a point on that pad's centre or on a via)
A1  (via drill 0.38)
  Top 0.254: U1.24 26.3,39.63 26.04,39.37 26.04,36.2 v25.4,35.56
  Bottom 0.254: v25.4,35.56 26.04,36.2 36.2,36.2 JP5.1
A2  (via drill 0.38)
  Top 0.254: v24.13,34.92 24.13,35.56 25.4,36.83 25.4,39.69 25.66,39.95 U1.25
  Bottom 0.254: JP5.2 25.4,36.83 24.13,35.56 v24.13,34.92
A3  (via drill 0.38)
  Top 0.254: v22.86,34.29 22.86,35.24 24.77,37.15 24.77,40.01 24.86,40.1 U1.26
  Bottom 0.254: v22.86,34.29 22.86,35.24 25.08,37.47 36.2,37.47 JP5.3
BATT_GND  (via drill 0.38, 0.51)
  Top 0.254: U1.14 24.06,33.47 24.88,34.29 v25.4,34.29 | v32.7,35.24 R7.2
  Bottom 0.254: v25.4,34.29 31.75,34.29 v32.7,35.24
BATT_LVL
  Top 0.254: U1.19 28.19,35.63 28.57,35.24 R7.1 R6.2
BT-RTS
  Top 0.254: JP5-DNP.6 24.98,47.84 R10.1
BT-RX
  Top 0.254: R9.1 17.46,49.53 18.1,48.9 18.1,47.94 JP5-DNP.4
D7
  Top 0.254: U1.11 21.66,30.55 JP6.1
D8
  Top 0.254: JP6.2 22.86,30.48 22.46,30.88 U1.12
D9
  Top 0.254: U1.13 23.26,31.35 JP6.3
DTR
  Top 0.254: S3.5 12.7,39.37 14.39,41.06 C4.1
GND  (via drill 0.38, 0.51)
  Top 0.254: v36.83,26.67 38.31,28.16 C10.2 41.06,29.21 46.99,29.21 48.26,27.94 48.26,25.72 47.94,25.4 U7.7 | v36.83,24.13 38.31,22.64 C11.2 41.27,22.64 44.03,25.4 46.99,25.4 | 33.66,12.06 39.37,12.06 C9.2 41.7,9.53 45.09,9.53 45.72,10.16 U5.GND U5.7
  Bottom 0.254: 34.29,26.67 v36.83,26.67 37.65,26.67 38.1,26.22 38.1,24.58 37.65,24.13 v36.83,24.13
  other vias: 17.46,32.7 13.02,55.56 20.32,61.72 32.7,32.07 23.18,15.56 16.19,25.4 19.05,11.43 30.48,19.68 20,35.24 30.48,16.83 3.81,35.24 31.11,29.21 41.91,41.91 33.02,39.37 15.24,61.72 22.23,51.44 17.78,58.42 17.78,64.77 7.62,41.91 11.75,34.92 23.5,19.37 16.51,30.16 32.38,8.57 29.53,8.57
  pour Bottom (isolate 0.406): 34.29,0 34.29,33.02 50.8,33.02 50.8,66.04 0,66.04 0,0
  pour Top (isolate 0.305): 34.29,0 34.29,33.02 50.8,33.02 50.8,66.04 0,66.04 0,0
LIGHT  (via drill 0.51)
  Top 0.254: SJ1.1 46.58,33.88 JP7.1 | U1.22 28.19,38.03 29.21,39.05 v30.48,39.05
  Bottom 0.254: v30.48,39.05 31.43,38.1 34.92,38.1 37.47,40.64 38.73,40.64 43.81,35.56 JP7.1
MISO
  Top 0.254: JP3.1 26.59,26.67 27.62,27.7 27.62,30.16 25.66,32.12 U1.16
MOSI  (via drill 0.51)
  Top 0.254: U1.15 24.86,31.97 26.99,29.84 26.99,28.26 26.67,27.94 21.91,27.94 21.59,27.62 21.59,25.4 JP3.4 24.13,22.86 v31.75,22.86 | R2.2 v14.29,3.81
  Bottom 0.254: v14.29,3.81 33.02,3.81 34.29,5.08 34.29,12.38 31.75,14.92 v31.75,22.86
N$1
  Top 0.254: R1.1 D1.A
N$2
  Top 0.254: JP10-DNP.2 14.61,55.88 14.61,56.01 14.61,58.67 15.24,59.31 20.7,59.31 21.59,58.42 R13.2
N$3
  Top 0.254: R14.2 11.43,58.41 | JP10-DNP.3 15.56,50.48 13.97,50.48 13.02,51.44 13.02,52.77 13.97,53.72 13.97,57.78 13.34,58.42 R14.2 | R14.2 11.43,58.42
N$5
  Top 0.254: R2.1 D2.A
N$6
  Top 0.254: U2.4 22.86,18.42 24.13,17.14 C6.1
N$7
  Top 0.254: JP9-DNP.3 37.47,57.78 38.1,58.42 40.64,58.42 41.91,57.15 R11.2
N$8
  Top 0.254: U1.20 29.63,36.43 C3.1
N$9
  Top 0.254: SJ1.2 43.83,34.71 U6.COLLECTOR 44.71,36.24 R8.2
N$10
  Top 0.254: U1.7 17.24,34.83 16.58,35.49 Y1.1
N$11
  Top 0.254: JP9-DNP.4 38.73,57.13 R12.1
N$12
  Top 0.254: JP10-DNP.5 19.68,57.15 R15.1
N$13
  Top 0.254: JP10-DNP.4 18.41,56.09 R16.1
N$14
  Top 0.254: U1.8 17.52,34.03 16.58,33.09 Y1.3
N$22
  Top 0.254: R18.1 D12.A
N$23
  Top 0.254: JP4.D- 9.36,12.23 10.16,11.43 12.6,11.43 R21.2
N$24
  Top 0.254: JP4.D+ 9.21,11.43 9.53,11.11 9.53,9.21 10.16,8.57 13.65,8.57 R22.2
N$25
  Top 0.254: JP4.VBUS 9.33,13.03 10.28,13.98 D13.2 10.28,17.46 10.6,17.78 12.99,17.78 15.24,15.54 15.24,13.02 18.73,9.53 U8.15
N$26
  Top 0.254: U8.13 17.46,6.35 C8.1 | U8.14 18.1,6.35 C8.1 | U8.3 20.64,12.38 22.86,10.16 22.86,6.35 22.54,6.03 17.68,6.03 C8.1
PROG
  Top 0.254: R20.1 R19.1 24.77,10.48 U4.5
RAIN
  Top 0.254: U1.32 20.06,42.28 20.32,42.55 22.86,42.55 24.13,43.81 28.57,43.81 30.48,45.72 43.81,45.72 44.44,46.34 44.44,52.21 43.94,52.71 D5.2 43.94,54.09 44.13,54.29 46.04,54.29 46.23,54.48 D6.1 46.23,57.15 R11.1 45.72,57.13
RAIN2
  Bottom 0.254: JP9-DNP.2 36.2,50.8 37.47,49.53 41.91,49.53 45.72,53.34 JP7.8
RAIN5
  Bottom 0.254: JP9-DNP.5 41.91,52.07 45.72,55.88 JP7.9
RF-CTS  (via drill 0.51)
  Top 0.254: JP5-DNP.1 11.43,45.72 9.53,43.81 v9.53,41.91 | U1.9 20.06,31.11 v20,31.11
  Bottom 0.254: v9.53,41.91 12.06,41.91 16.19,37.78 16.19,32.07 17.14,31.11 v20,31.11 20,33.34 25.72,39.05 28.89,39.05 30.48,40.64 30.48,46.75 JP6-DNP.12
RF-DTR
  Top 0.254: S3.6 11.71,43.47 12.7,44.45 17.78,44.45 19.05,43.18 22.54,43.18 27.3,47.94 27.3,56.98 JP6-DNP.17 31.72,58.45 33.02,57.15 SJ2.1
RF-RTS  (via drill 0.38, 0.51)
  Top 0.254: R10.2 D4.1 21.47,49.41 v20.32,48.26 | SJ2.2 31.57,55.43 30.55,56.45 JP6-DNP.16 | U1.10 20.86,34.04 23.81,36.99 v23.81,38.42
  Bottom 0.254: v20.32,48.26 20.32,45.72 19.68,45.09 19.68,39.05 20.32,38.42 v23.81,38.42 25.4,40.01 28.57,40.01 29.21,40.64 29.21,41.91 27.3,43.81 27.3,54.98 JP6-DNP.16
RF-RX  (via drill 0.51)
  Top 0.254: 12.7,45.09 12.06,45.09 10.48,43.5 10.48,40.64 9.53,39.69 8.26,39.69 S3.3 | 12.7,45.09 v22.86,45.09 | 12.7,45.09 12.7,49.53 D3.1 R9.2
  Bottom 0.254: JP6-DNP.2 9.1,64.77 15.88,64.77 24.77,55.88 24.77,48.9 26.04,47.62 26.04,46.04 25.08,45.09 v22.86,45.09
RST  (via drill 0.38, 0.51)
  Top 0.254: S2.3 18.4,25.39 | S2.3 18.41,26.67 | 18.41,26.67 S2.4 18.41,32.38 22.86,36.83 v22.86,37.47 22.86,40.01 22.46,40.41 U1.29 | C4.2 14.5,42.76 13.97,42.23 v13.97,41.91 | JP3.5 18.41,26.67 | R3.1 18.41,22.86 S2.3
  Bottom 0.254: v22.86,37.47 21.59,36.2 19.68,36.2 v13.97,41.91
RX  (via drill 0.38, 0.51)
  Top 0.254: 6.35,39.37 S3.2 v3.81,39.37 2.54,40.64 JP9.1 | U1.30 21.66,40.25 22.23,39.69 22.23,38.36 21.33,37.47 v20.32,37.47
  Bottom 0.254: v3.81,39.37 3.81,41.27 5.71,43.18 14.61,43.18 v20.32,37.47
SCK
  Top 0.254: JP3.3 24.13,25.4 26.67,25.4 28.26,26.99 28.26,30.48 27.15,31.59 U1.17
SCL  (via drill 0.51)
  Top 0.254: 30.9,43.18 v36.83,43.18 36.83,40.64 35.56,39.37 v35.56,23.5 37.47,21.59 45.09,21.59 45.72,22.23 U7.5 | 30.9,43.18 24.45,43.18 23.26,41.99 U1.28 | U5.SCK 44.72,14.97 44.45,15.24 42.55,15.24 v40.64,13.34 | R5.2 30.9,43.18
  Bottom 0.254: v40.64,13.34 37.04,13.34 35.56,14.81 v35.56,23.5 | v36.83,43.18 38.1,43.18 45.72,50.8 JP7.7
SDA  (via drill 0.51)
  Top 0.254: 30.9,42.55 34.92,42.55 v35.56,41.91 35.56,40.64 34.92,40.01 34.92,31.11 34.29,30.48 v34.29,22.86 36.2,20.95 45.65,20.95 47.22,22.53 U7.6 | 30.9,42.55 24.77,42.55 24.06,41.84 U1.27 | U5.DATA 44.72,10.43 44.45,10.16 42.55,10.16 v40.64,12.06 | R4.2 30.9,42.55
  Bottom 0.254: v40.64,12.06 37.09,12.06 34.29,14.87 v34.29,22.86 | v35.56,41.91 39.37,41.91 45.72,48.26 JP7.6
STAT
  Top 0.254: U4.1 30.8,10.48 31.11,10.16 31.11,4.45 30.48,3.81 D12.C
TX  (via drill 0.38, 0.51)
  Top 0.254: U1.31 20.86,39.47 v20.95,39.37 | U8.4 v20,15.88
  Bottom 0.254: v20.95,39.37 21.59,40.01 JP5-DNP.5 23.5,48.9 23.5,55.24 15.24,63.5 9.83,63.5 JP6-DNP.3 4.45,58.12 4.45,50.8 | 4.45,50.8 4.45,45.72 1.27,42.55 1.27,29.53 3.81,26.99 3.81,19.37 7.3,15.88 v20,15.88 | JP9.2 4.45,50.8
USB-DTR  (via drill 0.51)
  Top 0.254: S3.4 10.16,35.31 v10.16,26.67 | v13.97,20.32 13.97,19.05 15.88,17.14 20.95,17.14 21.91,16.19 U8.1
  Bottom 0.254: v13.97,20.32 13.97,24.13 11.43,26.67 v10.16,26.67
USB-RX  (via drill 0.51)
  Top 0.254: 6.03,36.84 S3.1 6.03,36.83 3.81,36.83 2.54,35.56 v2.54,26.67 | U8.20 v21.91,6.99
  Bottom 0.254: v2.54,26.67 2.54,19.05 6.99,14.61 18.41,14.61 21.91,11.11 v21.91,6.99
USB_D+
  Top 0.254: U8.11 16.19,10.06 15.88,10.38 R22.1
USB_D-
  Top 0.254: R21.1 14.39,14.19 14.61,13.97 14.61,12.7 16.83,10.48 U8.12
VBAT  (via drill 0.51)
  Top 0.254: v32.7,33.66 R6.1 | JP2.2 11.16,22.59 JP1.2 6.62,22.59 6.35,22.86 v6.35,25.4 6.35,27.98 S1.1 | U4.3 32.38,12.38 | 32.38,12.38 C14.1 | 32.38,12.38 32.38,13.26 31.68,13.97 v26.67,13.97
  Bottom 0.254: v32.7,33.66 27.94,28.89 27.94,24.45 25.08,21.59 | 25.08,21.59 18.41,21.59 17.46,22.54 17.46,26.62 16.46,27.62 8.57,27.62 v6.35,25.4 | 25.08,21.59 25.08,15.56 v26.67,13.97
VCC  (via drill 0.51)
  Top 0.254: v9.53,60.96 C12.1 | v9.53,60.96 9.53,61.59 | U1.6 17.71,35.63 17.14,36.2 17.14,37.23 | R5.1 v34.29,44.45 45.72,44.45 | 45.72,44.45 45.72,45.72 | 38.73,25.4 38.73,26.04 39.16,26.45 C10.1 40.96,26.45 42.44,27.94 45.4,27.94 45.72,27.62 U7.2 | 38.73,25.4 38.73,24.77 39.16,24.34 C11.1 40.96,24.34 43.46,26.85 U7.3 | v36.83,25.4 38.73,25.4 | 33.02,30.48 30.29,30.48 29.84,30.93 29.84,32.05 C1.1 28.89,32.07 28.57,32.38 28.57,34.29 28.04,34.83 U1.18 | JP6-DNP.1 8.58,62.65 C12.1 | 33.02,30.48 34.29,31.75 v34.29,40.64 33.66,41.27 R4.1 32.38,41.27 | R1.2 v5.4,3.81 | v33.02,24.13 33.02,21.91 | 33.02,21.91 33.02,15.98 35.45,13.55 C9.1 41.7,15.88 45.09,15.88 45.72,15.24 U5.VDD | v9.53,60.96 8.89,60.33 8.89,55.37 D9.1 | 26.04,54.61 26.04,53.34 25.4,52.7 R17.1 | 26.04,54.61 D7.1 | D5.1 46.23,52.59 45.72,52.07 45.72,45.72 | 45.72,44.45 45.72,40.64 | 18.93,63.5 D11.1 | 18.93,63.5 25.4,63.5 26.04,62.87 26.04,54.61 | 18.93,63.5 11.43,63.5 10.58,62.65 C12.1 | 45.72,45.72 JP7.5 | 45.72,40.64 JP7.3 | 45.72,40.64 R8.1 | U1.4 17.14,37.23 | 17.14,37.23 15.24,37.23 C2.1 14.39,37.25 13.34,36.2 v13.34,30.48 13.34,24.77 15.24,22.86 R3.2 16.3,22.23 16.61,21.91 25.4,21.91 | 25.4,21.91 33.02,21.91 | 25.4,21.91 25.4,19.82 C7.A 24.64,20.32 U2.5 | JP8.1 2.54,59.27 3.17,59.91 R23.1 | JP3.2 v33.02,24.13 | v33.02,24.13 33.02,30.48
  Bottom 0.254: v9.53,60.96 8.89,60.33 8.89,45.72 7.62,44.45 4.45,44.45 1.91,41.91 1.91,30.48 3.17,29.21 5.08,29.21 6.35,30.48 v13.34,30.48 | v5.4,3.81 6.67,2.54 33.76,2.54 35.56,4.34 35.56,12.38 33.02,14.92 v33.02,24.13 34.29,25.4 v36.83,25.4 | v34.29,40.64 v34.29,44.45 | JP8.1 2.54,58.3 5.08,60.84 5.08,62.75 JP6-DNP.1
VRAW  (via drill 0.51)
  Top 0.254: v3.81,30.48 S1.2 6.99,30.48 7.62,29.84 7.62,27.3 9.53,25.4 11.75,25.4 15.24,21.91 15.24,19.05 15.77,18.52 C5.1 16.61,18.42 17.78,18.42 | 17.78,18.42 U2.3 | U2.1 18.1,20.32 17.78,20 17.78,18.42
  Bottom 0.254: JP5-DNP.2 10.79,43.81 5.08,43.81 2.54,41.27 2.54,31.75 v3.81,30.48
VUSB  (via drill 0.51)
  Top 0.254: JP10.2 11.43,15.36 D13.1 | C15.1 25.4,6.99 v24.13,5.71 24.13,3.81 R18.2 | 27.62,6.99 C15.1 | U4.4 28.26,12.38 28.57,12.06 28.57,9.53 27.73,8.68 C15.1
  Bottom 0.254: JP10.2 18.41,5.71 v24.13,5.71
WDIR  (via drill 0.51)
  Top 0.254: v27.94,41.27 28.57,40.64 28.57,39.37 28.04,38.83 U1.23 | v26.04,50.8 24.13,50.8 23.28,51.65 R17.2 22.98,52.7 D7.2 22.98,55.37 23.18,55.56 25.08,55.56 25.28,55.76 D8.1 | D8.1 25.4,56.52 | D8.1 25.28,58.42 R13.1
  Bottom 0.254: v26.04,50.8 26.68,50.16 26.68,42.54 v27.94,41.27
WSPEED
  Top 0.254: U1.1 18.57,42.39 17.14,43.81 13.97,43.81 13.02,42.86 13.02,41.59 12.06,40.64 11.43,40.64 9.84,39.05 7.94,39.05 6.35,40.64 5.08,40.64 4.45,41.27 4.45,43.81 5.08,44.45 7.62,44.45 9.21,46.04 9.21,50.48 11.43,52.7 11.43,54.09 D9.2 | D9.2 11.94,54.61 | D9.2 | D9.2 11.95,55.37 11.75,55.56 9.84,55.56 9.64,55.76 D10.1 9.64,58.42 R14.1
XSLEEP  (via drill 0.51)
  Top 0.254: R23.2 4.76,50.47 JP6-DNP.9 8.57,50.24 8.57,51.12 v10.16,52.7 | U1.2 17.53,38.83 17.14,39.22 v17.14,41.91
  Bottom 0.254: v17.14,41.91 15.24,43.81 15.24,47.62 v10.16,52.7

### Text on the board
Bottom: V40
tPlace: Wind | Rain | XBee | BlueSMiRF | RF | Comm | USB | Light | OFF | Power | ON | + | RST | 3.7-12V | ISP | Pressure | - | + | - | Humidity | Power | Status | Charge | USB | Weather | V4
bPlace: 1 | 20 | 33 | 5 | GD | 2 | TX | WIND | RAIN | SCL | RX | SDA | 10 | 11 | CTS | VRAW | GND | RX-I | TX-O | BT-RTS | 3.3V | GND | 3.3V | A3 | GND | A2 | LIGHT | A1 | D7 | D8 | D9 | RST | MISO | BAT | GND | MOSI | 3.3V | SCK | 3.7-12V | GND | CHARGE | 4.2-6V | GND
tValues: DNP | DNP | DNP | SMD Button | USB Weather Board v3
tDocu: 0.00" | 0.10" | 0.70" | 1.50" | 1.90" | 2.00" | 2.60" | 2.50" | 0.85" | 0.45" | 0.10" | 0.00" | R. Owens, M. Grusin